# EasyEDA Pro project ProDoc_Schematic1.epro

# Schematic Schematic1

## Sheets
1 P1: Board Name: Board1; Create Date: 2025-09-09; Page Name: P1; Project Name: usbc-fursuit-fan; Schematic Name: Schematic1; Update Date: 2025-09-09; Company: EasyEDA.com; Page Size: A4; Version: V1.0
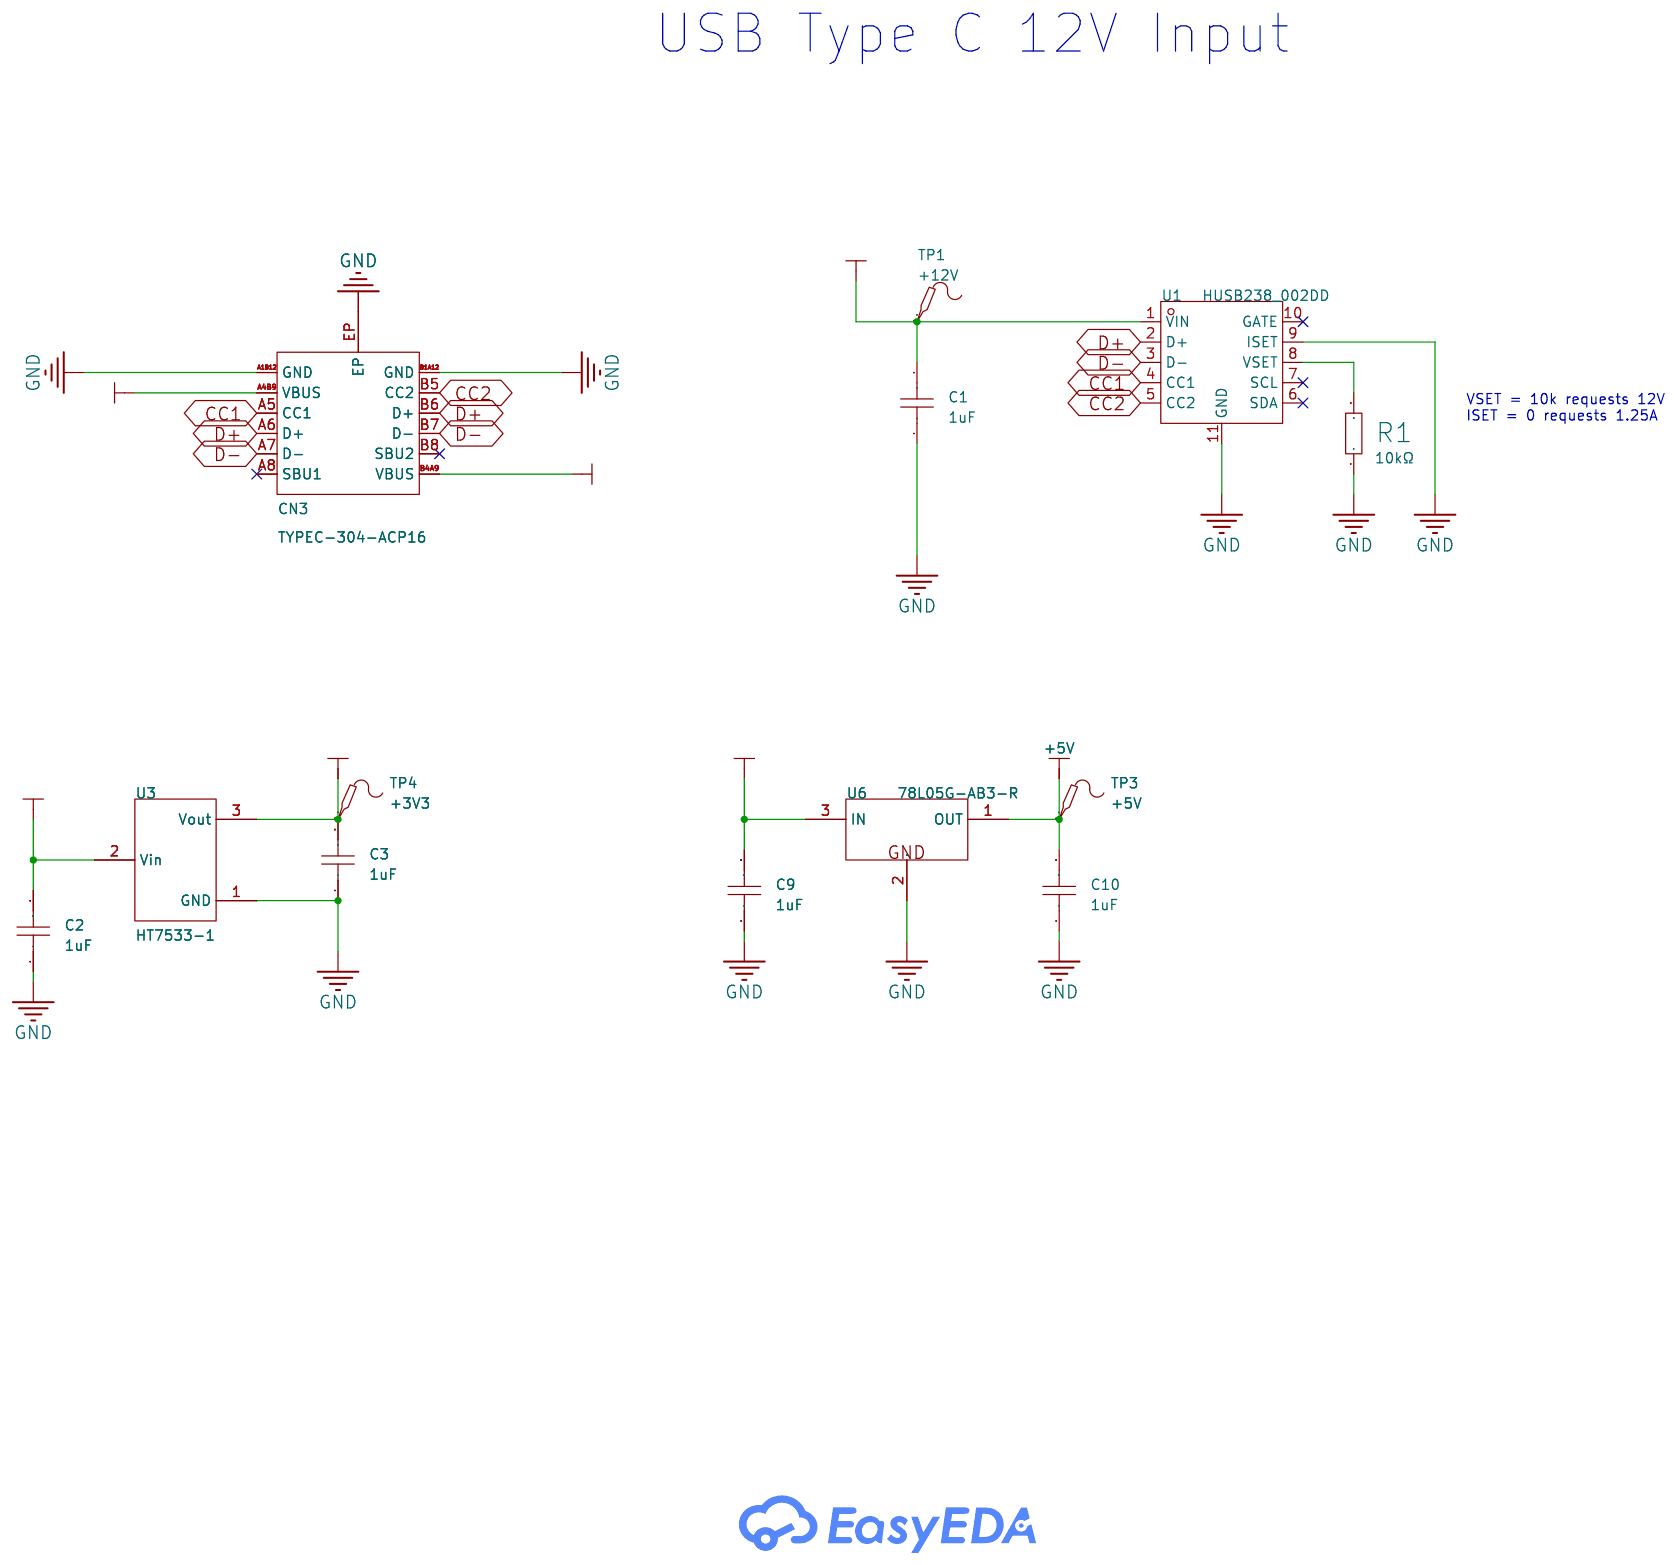
[diagram p0: P1]
2 P2: Page Name: P2; Update Date: 2025-09-11
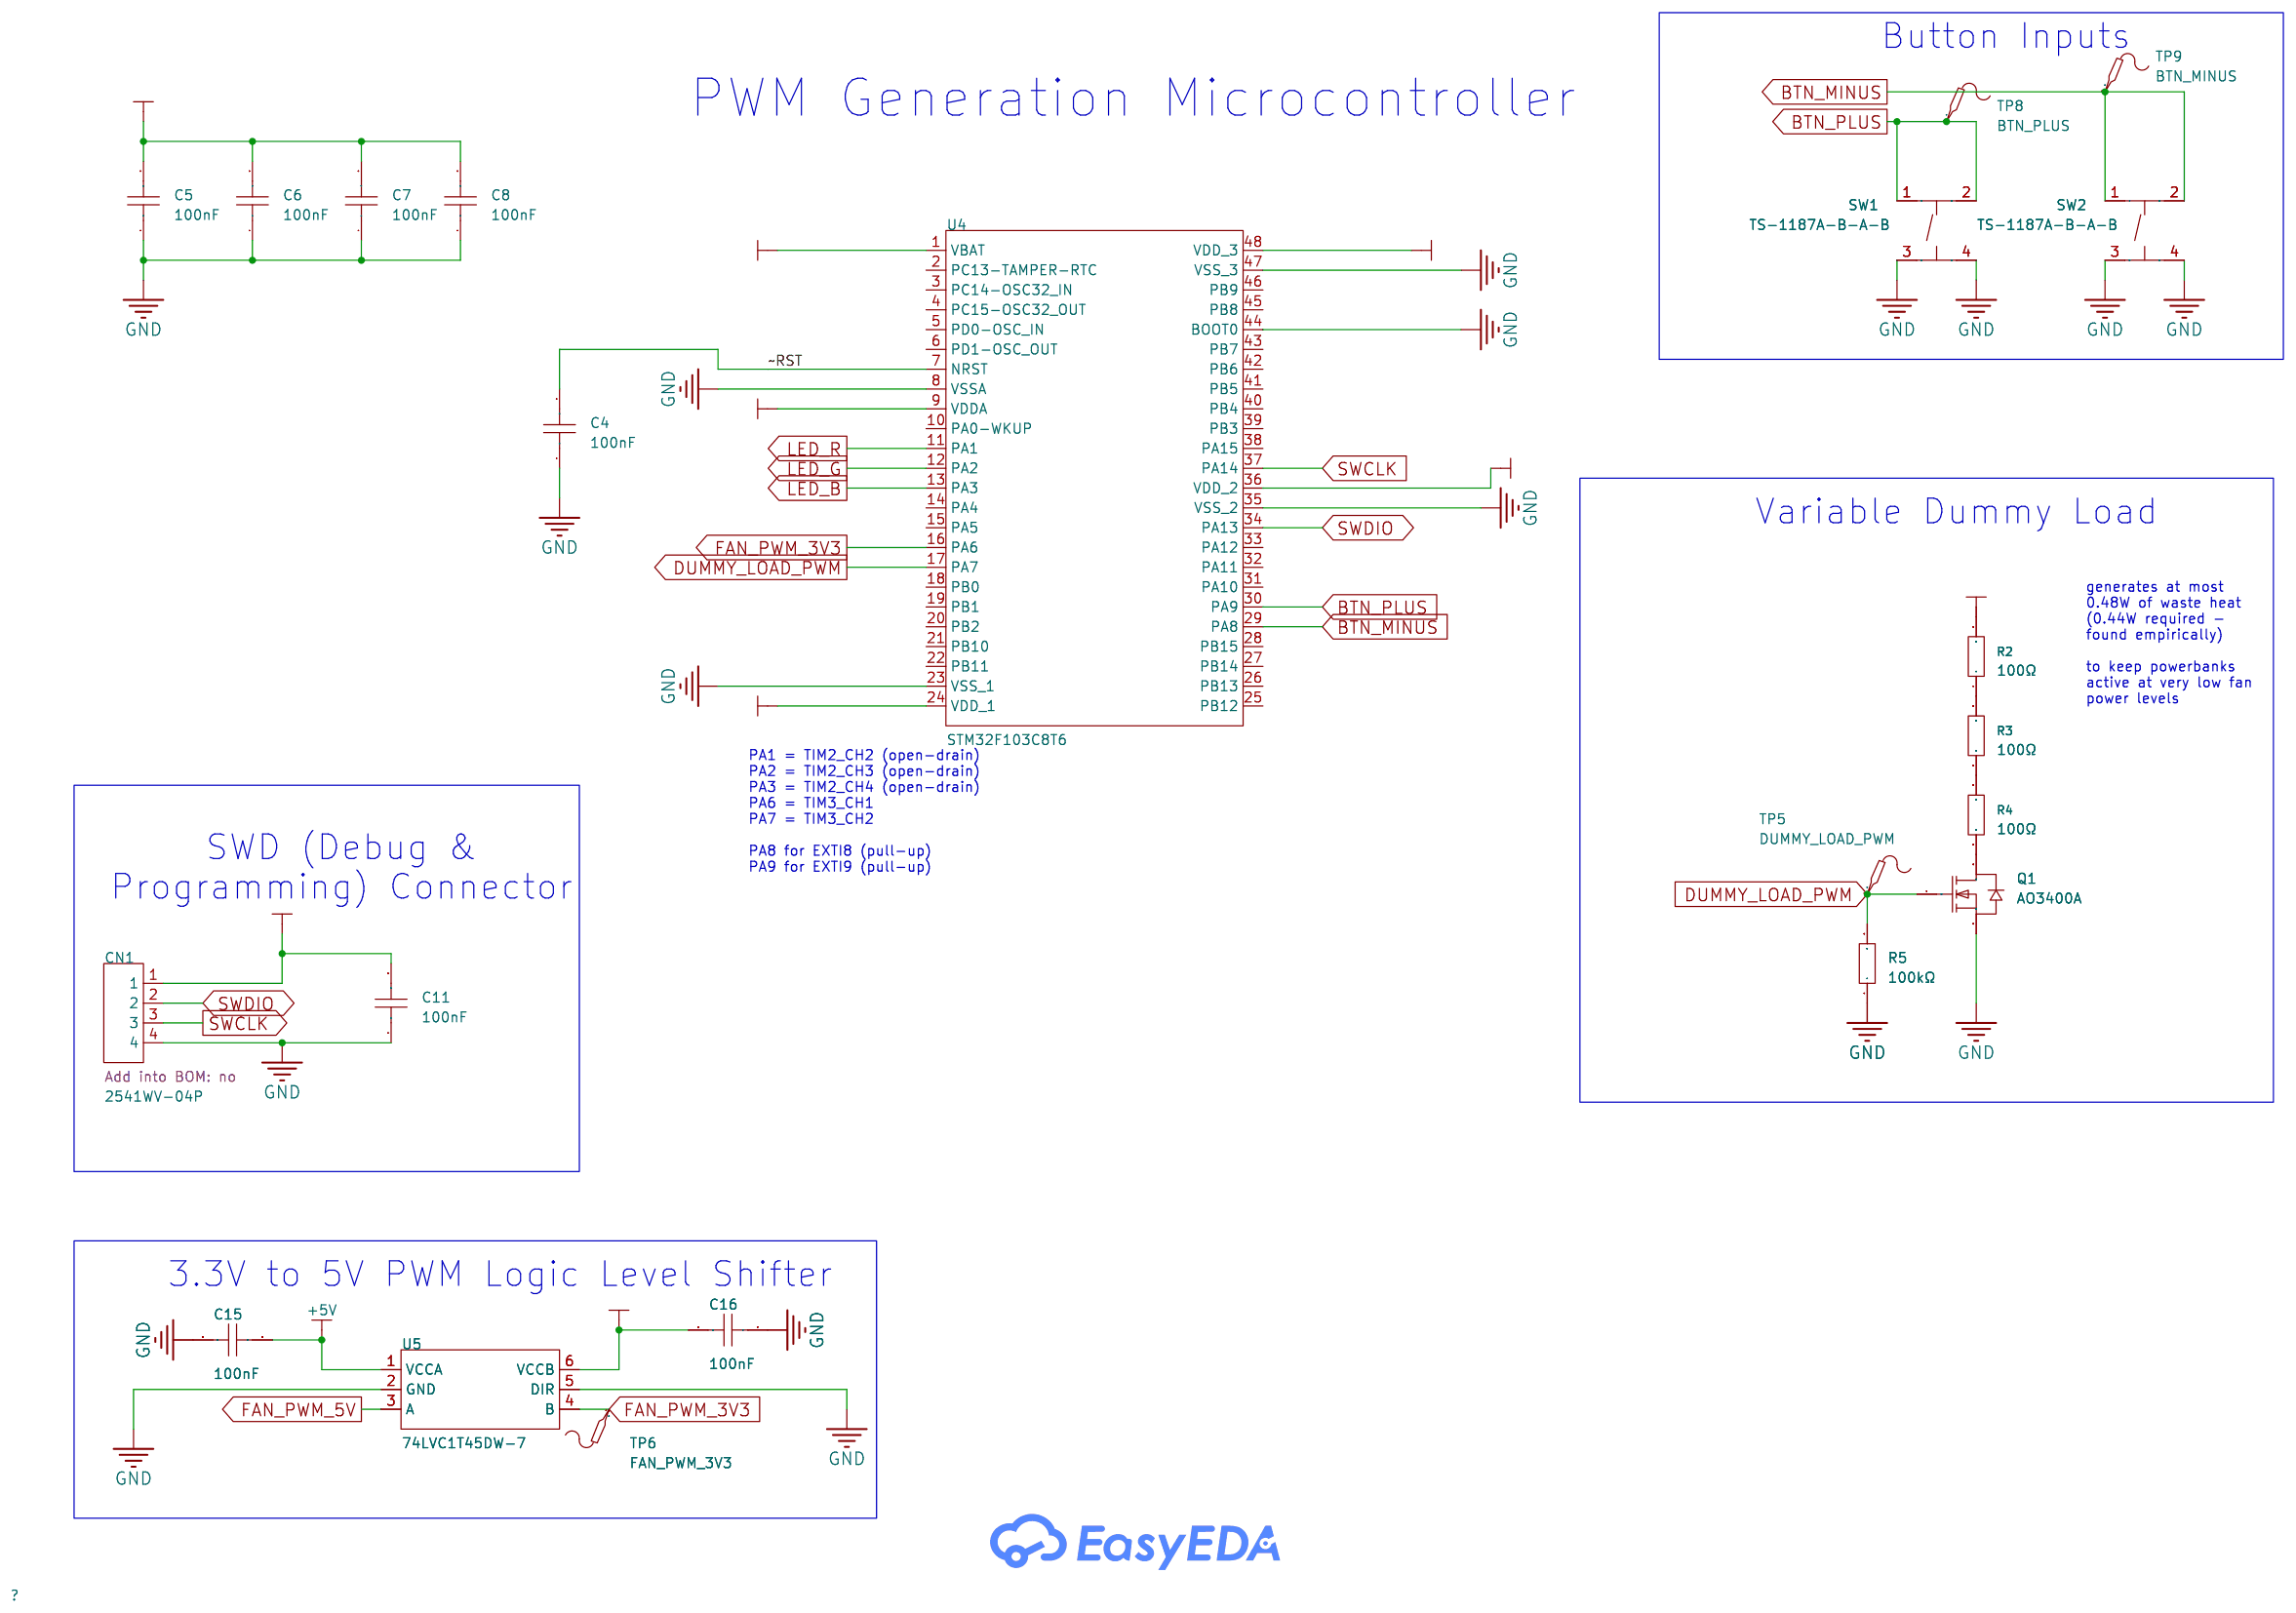
[diagram p1: P2]
3 P3: Page Name: P3; Update Date: 2025-09-11
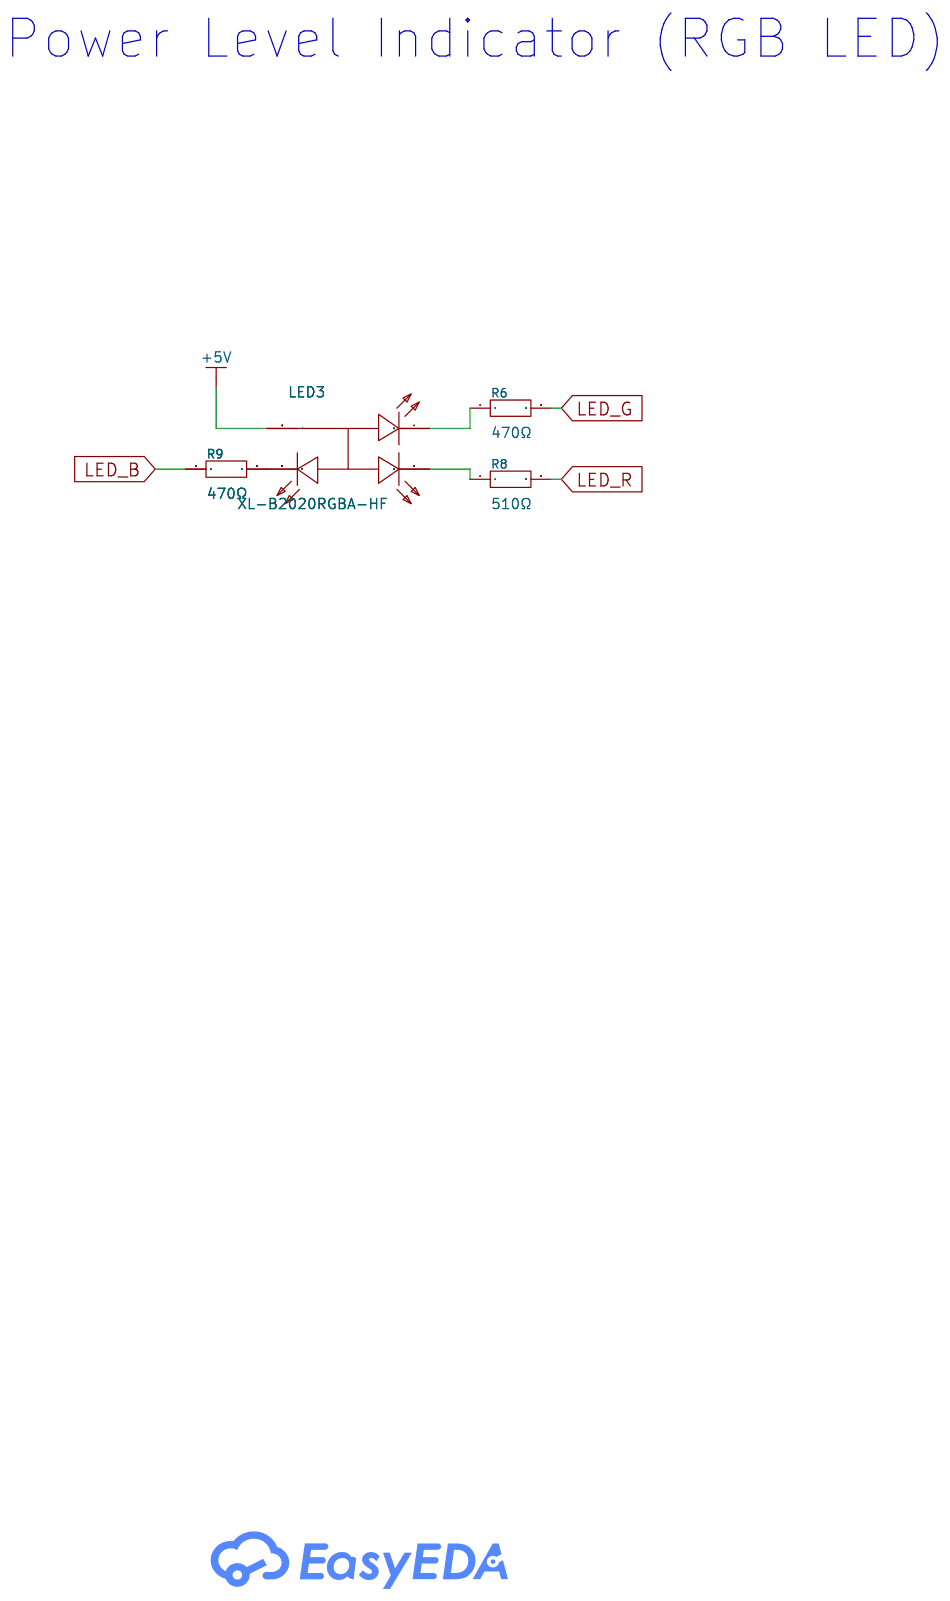
[diagram p2: P3]
4 P4: Create Date: 2025-09-10; Page Name: P4; Update Date: 2025-09-11
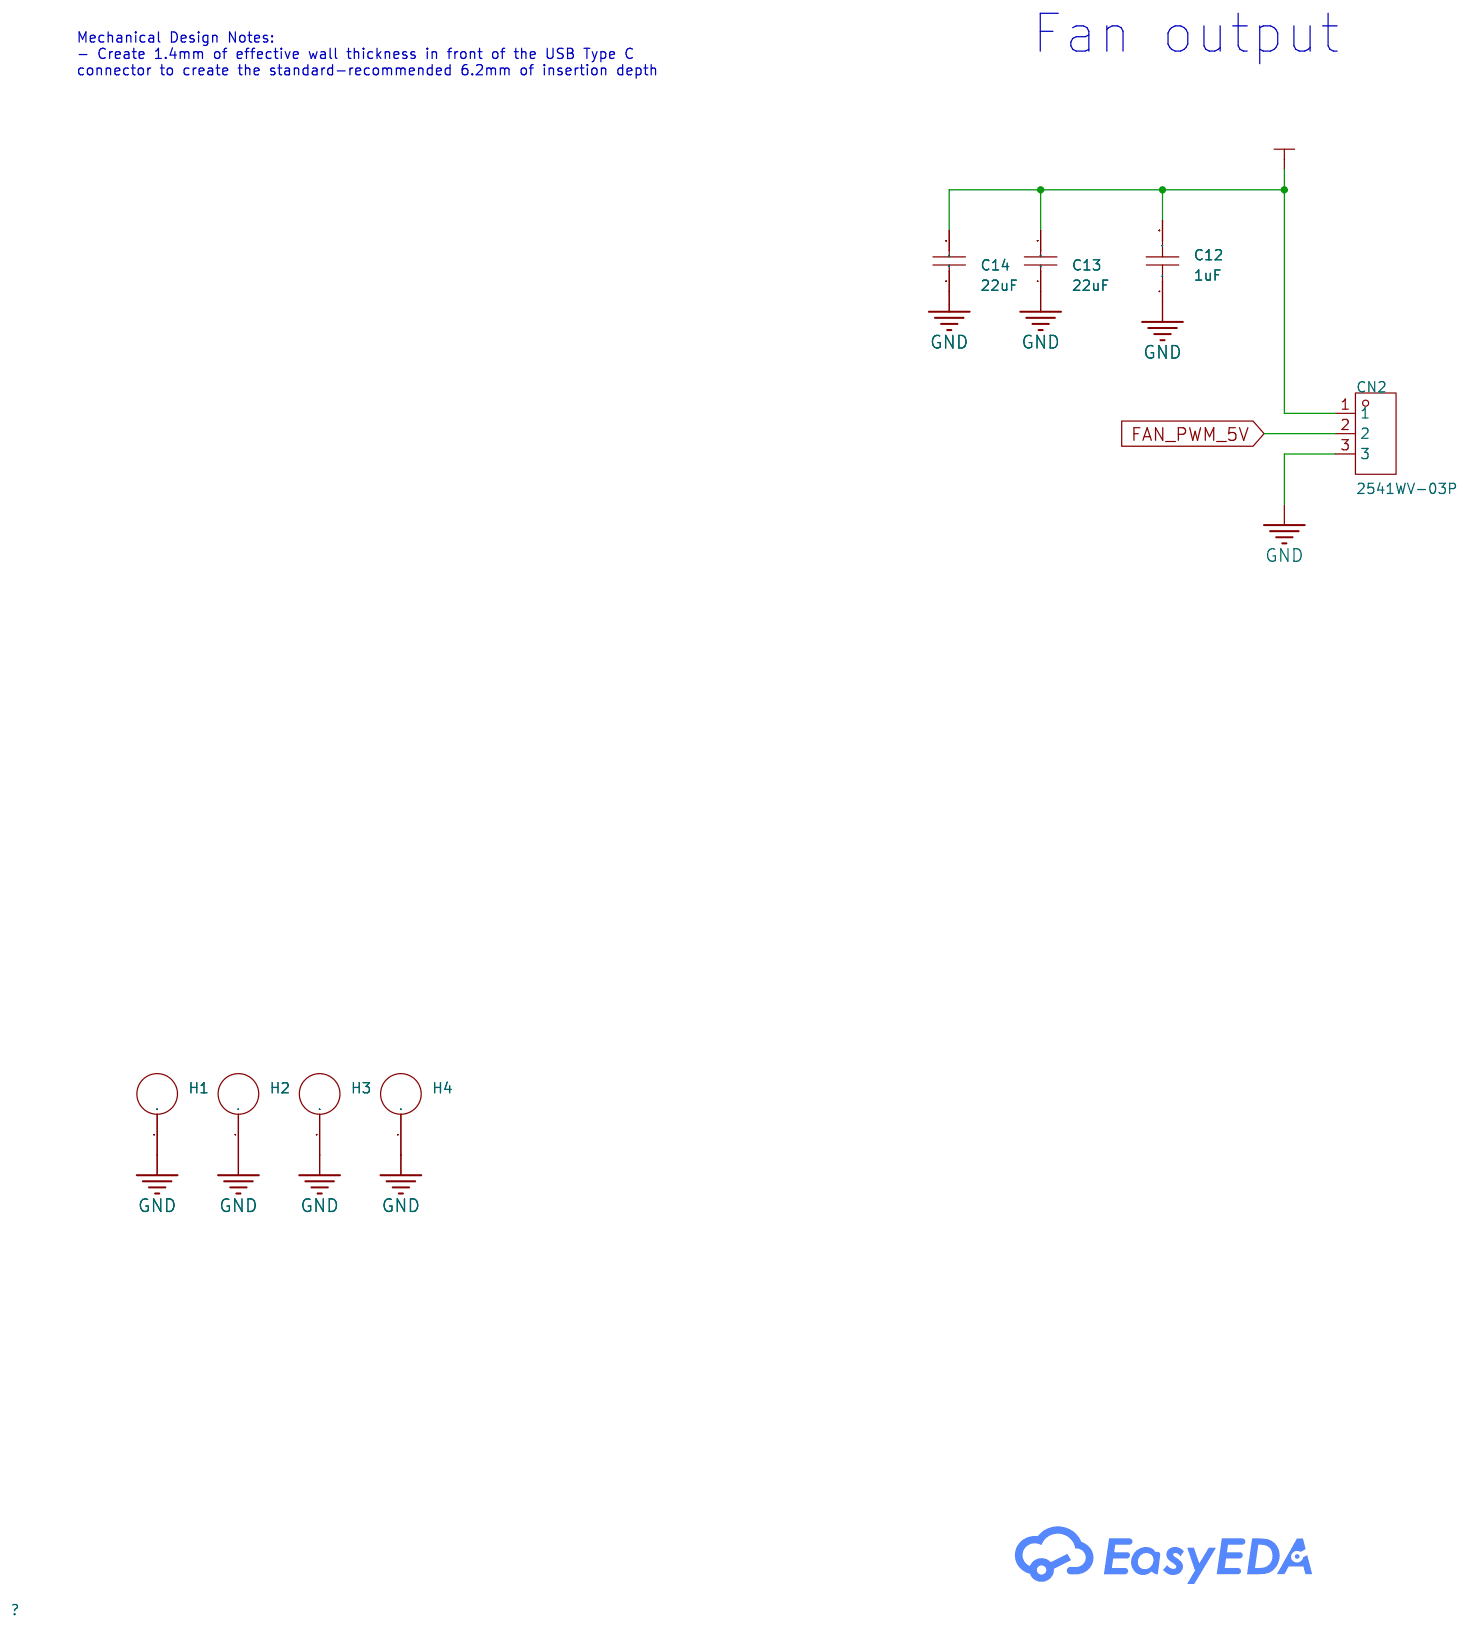
[diagram p3: P4]

## Parts
sheet P1
C1  1uF  [C0603]
C2  1uF  [C0603]
C3  1uF  [C0603]
C9  1uF  [C0603]
C10  1uF  [C0603]
CN3  TYPEC-304-ACP16  [USB-C-SMD_TYPE-C-16P-1]
R1  10kΩ  [R0603]
TP1  +12V  [Test-Point-0.5mm]
TP3  +5V  [Test-Point-0.5mm]
TP4  +3V3  [Test-Point-0.5mm]
U1  HUSB238_002DD  [DFN-10_L3.0-W3.0-P0.50-BL-EP2.5]
U3  HT7533-1  [SOT-89-3_L4.5-W2.5-P1.50-LS4.2-BR]
U6  78L05G-AB3-R  [SOT-89-3_L4.5-W2.5-P1.50-LS4.2-BR]
sheet P2
C4  100nF  [C0603]
C5  100nF  [C0603]
C6  100nF  [C0603]
C7  100nF  [C0603]
C8  100nF  [C0603]
C11  100nF  [C0603]
C15  100nF  [C0603]
C16  100nF  [C0603]
CN1  2541WV-04P  [HDR-TH_4P-P2.54-V-M-1]  (no BOM)
Q1  AO3400A  [SOT-23-3_L2.9-W1.3-P1.90-LS2.4-BR]
R2  100Ω  [R1206]
R3  100Ω  [R1206]
R4  100Ω  [R1206]
R5  100kΩ  [R0603]
SW1  TS-1187A-B-A-B  [SW-SMD_4P-L5.1-W5.1-P3.70-LS6.5-TL_H1.5]
SW2  TS-1187A-B-A-B  [SW-SMD_4P-L5.1-W5.1-P3.70-LS6.5-TL_H1.5]
TP5  DUMMY_LOAD_PWM  [Test-Point-0.5mm]
TP6  FAN_PWM_3V3  [Test-Point-0.5mm]
TP8  BTN_PLUS  [Test-Point-0.5mm]
TP9  BTN_MINUS  [Test-Point-0.5mm]
U4  STM32F103C8T6  [LQFP-48_L7.0-W7.0-P0.50-LS9.0-BL]
U5  74LVC1T45DW-7  [SC-70-6_L2.2-W1.3-P0.65-LS2.1-BR]
sheet P3
LED3  XL-B2020RGBA-HF  [LED-SMD_4P-L2.1-W2.1-P1.0-BL]
R6  470Ω  [R0402]
R8  510Ω  [R0402]
R9  470Ω  [R0402]
sheet P4
C12  1uF  [C0603]
C13  22uF  [C1206]
C14  22uF  [C1206]
CN2  2541WV-03P  [HDR-TH_3P-P2.54-V-M-2]  (no BOM)
H1  -  [HOLE_D2M5_D4M0_PAD_PTH]
H2  -  [HOLE_D2M5_D4M0_PAD_PTH]
H3  -  [HOLE_D2M5_D4M0_PAD_PTH]
H4  -  [HOLE_D2M5_D4M0_PAD_PTH]

## Library data of the parts
C1-C3 C9 C10 C12 = CL10A105KB8NNNC: Capacitance:1uF Tolerance:±10% Tolerance:±10% Voltage Rating:50V Temperature Coefficient:X5R; LCSC Part Name: 1uF ±10% 50V; Supplier Part: C15849; Manufacturer: SAMSUNG(三星); Supplier Footprint: 0603; JLCPCB Part Class: Basic Part; Datasheet: https://item.szlcsc.com/datasheet/CL10A105KB8NNNC/16531.html; Supplier: LCSC; Tolerance: ±10%; Voltage Rating: 50V; Temperature Coefficient: X5R
CN3 = TYPEC-304-ACP16: Connector Type:Type-C Protocol Standard:- Gender:Female Mounting Type:Surface Mount, Right Angle Number of Contacts:16P Number of Ports:1 Current Rating-Power:3A Voltage Rating:20V Connect-Disconnect Life:10,000 Cycles Length:7.35mm Detection color:Black; LCSC Part Name: Type-C 母 卧贴; Supplier Part: C2982555; Manufacturer: XUNPU(讯普); Supplier Footprint: SMD; JLCPCB Part Class: Extended Part; Datasheet: https://item.szlcsc.com/datasheet/TYPEC-304-ACP16/3412817.html; Supplier: LCSC; Connector Type: Type-C; Gender: Female; Mounting Type: Surface Mount, Right Angle; Number of Contacts: 16P; Number of Ports: 1; Current Rating-Power: 3A; Voltage Rating: 20V; Connect-Disconnect Life: 10,000 Cycles; Length: 7.35mm; Detection color: Black; Operating Temperature: -40℃~+85℃
R1 = 0603WAF1002T5E: Type:Thick Film Resistor Resistance:10kΩ Tolerance:±1% Tolerance:±1% Power(Watts):100mW Voltage-Supply(Max):75V Temperature Coefficient:±100ppm/℃ Temperature Coefficient:±100ppm/℃ Operating Temperature:-55℃~+155℃ Operating Temperature:-55℃~+155℃; LCSC Part Name: 厚膜电阻 10kΩ ±1% 100mW; Supplier Part: C25804; Manufacturer: UNI-ROYAL(厚声); Supplier Footprint: 0603; JLCPCB Part Class: Basic Part; Datasheet: https://item.szlcsc.com/datasheet/0603WAF1002T5E/26547.html; Supplier: LCSC; Type: Thick Film Resistor; Tolerance: ±1%; Power(Watts): 100mW; Voltage-Supply(Max): 75V; Temperature Coefficient: ±100ppm/℃; Operating Temperature: -55℃~+155℃
TP1 TP3-TP6 TP8 TP9 = Test-Point: Test Point 测试点
U1 = HUSB238_002DD: Supplier Part: C7471904; Manufacturer: Hynetek(慧能泰); Supplier Footprint: DFN-10L(3x3); JLCPCB Part Class: Extended Part; Datasheet: https://item.szlcsc.com/datasheet/HUSB238_002DD/8528237.html; Supplier: LCSC
U3 = HT7533-1_C14289: Output Type:Fixed Voltage - Supply:30V Output Voltage:3.3V Output Voltage:3.3V Output Current:100mA Power Supply Rejection Ratio (PSRR):- Voltage Dropout:55mV@(1mA) standby current:- Output Configuration:Positive electrode Number of Outputs:1; LCSC Part Name: 输入30V 输出3.3V 100mA; Supplier Part: C14289; Manufacturer: HOLTEK(合泰/盛群); Supplier Footprint: SOT-89-3; JLCPCB Part Class: Basic Part; Datasheet: https://atta.szlcsc.com/upload/public/pdf/source/20250210/C9238B1D00F83046D6644632F130CE9C.pdf; Supplier: LCSC; Output Type: Fixed; Voltage - Supply: 30V; Output Voltage: 3.3V; Output Current: 100mA; Voltage Dropout: 55mV@(1mA); Output Configuration: Positive electrode; Number of Outputs: 1
U6 = 78L05G-AB3-R: Output Type:Fixed Voltage - Supply:30V Output Voltage:5V Output Voltage:5V Output Current:100mA Power Supply Rejection Ratio (PSRR):- Voltage Dropout:1.7V@(40mA) Noise:- Features:Short Circuit Protection；Over Temperature Protection；Over Current Protection; LCSC Part Name: 输入30V 输出5V 100mA; Supplier Part: C71136; Manufacturer: UTC(友顺); Supplier Footprint: SOT-89-3; JLCPCB Part Class: Basic Part; Datasheet: https://item.szlcsc.com/datasheet/78L05G-AB3-R/72235.html; Supplier: LCSC; Output Type: Fixed; Voltage - Supply: 30V; Output Voltage: 5V; Output Current: 100mA; Voltage Dropout: 1.7V@(40mA); Features: Short Circuit Protection；Over Temperature Protection；Over Current Protection; Operating Temperature: -40℃~+85℃; Output Configuration: Positive; Number of Outputs: 1
C4-C8 C11 C15 C16 = CC0603KRX7R9BB104: Capacitance:100nF Tolerance:±10% Tolerance:±10% Voltage Rating:50V Temperature Coefficient:X7R; LCSC Part Name: 100nF ±10% 50V; Supplier Part: C14663; Manufacturer: YAGEO(国巨); Supplier Footprint: 0603; JLCPCB Part Class: Basic Part; Datasheet: https://item.szlcsc.com/datasheet/CC0603KRX7R9BB104/15331.html; Supplier: LCSC; Tolerance: ±10%; Voltage Rating: 50V; Temperature Coefficient: X7R
CN1 = 2541WV-04P: Pin Structure:1x4P Pitch:2.54mm Circluar Pins/Square Pins:Pin Header Mounting Type:Through Hole Number of Rows:1 Number of Pins:4P Length of Mating Pin:6mm Insulation Height:2.54mm Length of End Connection Pin:3mm Contact Plating:Gold Operating Temperatur; LCSC Part Name: 1x4P 间距:2.54mm 方针 直插; Supplier Part: C5383113; Manufacturer: HanElectricity(瀚源); Supplier Footprint: 插件,P=2.54mm; JLCPCB Part Class: Extended Part; Datasheet: https://item.szlcsc.com/datasheet/2541WV-04P/6258473.html; Supplier: LCSC; Pin Structure: 1x4P; Pitch: 2.54mm; Circluar Pins/Square Pins: Pin Header; Mounting Type: Through Hole; Number of Rows: 1; Number of Pins: 4P; Length of Mating Pin: 6mm; Insulation Height: 2.54mm; Length of End Connection Pin: 3mm; Contact Plating: Gold; Operating Temperature: -55℃~+105℃
Q1 = AO3400A_C20917: Number:- Drain to Source Voltage:30V Current - Continuous Drain(Id):- RDS(on):48mΩ@2.5V Pd - Power Dissipation:- Gate Threshold Voltage (Vgs(th)):1.45V@250uA Gate Charge(Qg):7nC@10V Input Capacitance(Ciss):630pF@15V Reverse Transfer Capacitance (Crss@Vds); LCSC Part Name: 1个N沟道 耐压:30V 电流:5.7A; Supplier Part: C20917; Manufacturer: AOS; Supplier Footprint: SOT-23-3L; JLCPCB Part Class: Basic Part; Datasheet: https://item.szlcsc.com/datasheet/AO3400A/21629.html; Supplier: LCSC; Drain to Source Voltage: 30V; RDS(on): 48mΩ@2.5V; Gate Threshold Voltage (Vgs(th)): 1.45V@250uA; Gate Charge(Qg): 7nC@10V; Input Capacitance(Ciss): 630pF@15V; Operating Temperature: -55℃~+150℃@(Tj); Type: N-Channel
R2-R4 = 1206W4F1000T5E_C17901: Type:Thick Film Resistor Resistance:100Ω Tolerance:±1% Tolerance:±1% Power(Watts):250mW Voltage-Supply(Max):200V Temperature Coefficient:±100ppm/℃ Temperature Coefficient:±100ppm/℃ Operating Temperature:-55℃~+155℃ Operating Temperature:-55℃~+155℃; LCSC Part Name: 100Ω ±1% 250mW 厚膜电阻; Supplier Part: C17901; Manufacturer: UNI-ROYAL(厚声); Manufacturer Part: 1206W4F1000T5E; Supplier Footprint: 1206; JLCPCB Part Class: Basic Part; Datasheet: https://item.szlcsc.com/datasheet/1206W4F1000T5E/18589.html; Supplier: LCSC; Type: Thick Film Resistor; Tolerance: ±1%; Power(Watts): 250mW; Voltage-Supply(Max): 200V; Temperature Coefficient: ±100ppm/℃; Operating Temperature: -55℃~+155℃
R5 = 0603WAF1003T5E: Type:Thick Film Resistor Resistance:100kΩ Tolerance:±1% Tolerance:±1% Power(Watts):100mW Voltage-Supply(Max):75V Temperature Coefficient:±100ppm/℃ Temperature Coefficient:±100ppm/℃ Operating Temperature:-55℃~+155℃ Operating Temperature:-55℃~+155℃; LCSC Part Name: 100kΩ ±1% 100mW 厚膜电阻; Supplier Part: C25803; Manufacturer: UNI-ROYAL(厚声); Supplier Footprint: 0603; JLCPCB Part Class: Basic Part; Datasheet: https://item.szlcsc.com/datasheet/0603WAF1003T5E/26546.html; Supplier: LCSC; Type: Thick Film Resistor; Tolerance: ±1%; Power(Watts): 100mW; Voltage-Supply(Max): 75V; Temperature Coefficient: ±100ppm/℃; Operating Temperature: -55℃~+155℃
SW1 SW2 = TS-1187A-B-A-B: Circuit:SPST Actuator Style:Round Button Operating Force:1.6N Mounting Type:Surface Mount,Vertical Length:5.1mm Width:5.1mm Switch Height:1.5mm with Bracket:Without Bracket Contact Current:50mA Voltage Rating:12V Actuator/Cap Color:Gold With Lamp:No Life:; LCSC Part Name: 5.1*5.1*1.5mm 立贴 轻触开关; Supplier Part: C318884; Manufacturer: XKB Connection(中国星坤); Supplier Footprint: SMD; JLCPCB Part Class: Basic Part; Datasheet: https://item.szlcsc.com/datasheet/TS-1187A-B-A-B/299976.html; Supplier: LCSC; Circuit: SPST; Actuator Style: Round Button; Operating Force: 1.6N; Mounting Type: Surface Mount,Vertical; Length: 5.1mm; Width: 5.1mm; Switch Height: 1.5mm; with Bracket: Without Bracket; Contact Current: 50mA; Voltage Rating: 12V; Actuator/Cap Color: Gold; With Lamp: No; Life: 100,000 Cycles; Operating Temperature: -30℃~+85℃
U4 = STM32F103C8T6: CPU Core:ARM-M3 CPU Maximum Speed:72MHz Program Storage Size:64KB Program Memory Type:FLASH Number of I/O:37 ADC (Bit):12bit Voltage - Supply:2V~3.6V Voltage - Supply:2V~3.6V Applications:-; LCSC Part Name: 主流增强型ARM Cortex-M3 MCU，具有64 KB Flash、72 MHz CPU、电机控制、USB和CAN; Supplier Part: C8734; Manufacturer: ST(意法半导体); Supplier Footprint: LQFP-48(7x7); JLCPCB Part Class: Extended Part; Datasheet: https://item.szlcsc.com/datasheet/STM32F103C8T6/9243.html; Supplier: LCSC; CPU Core: ARM-M3; CPU Maximum Speed: 72MHz; Program Storage Size: 64KB; Program Memory Type: FLASH; Number of I/O: 37; ADC (Bit): 12bit; Voltage - Supply: 2V~3.6V
U5 = 74LVC1T45DW-7: Channel Type:Bidirectional Voltage - Supply(VCCA):1.65V~5.5V Voltage - Supply(VCCA):1.65V~5.5V Voltage - Supply(VCCB):1.65V~5.5V Voltage - Supply(VCCB):1.65V~5.5V Number of Circuits:1 Number of Circuits:1 Output Type:Tri-State Operating Temperature:-40℃~+; Supplier Part: C168855; Manufacturer: DIODES(美台); Supplier Footprint: SC-70-6(SOT-363); JLCPCB Part Class: Extended Part; Datasheet: https://item.szlcsc.com/datasheet/74LVC1T45DW-7/180239.html; Supplier: LCSC; Channel Type: Bidirectional; Voltage - Supply(VCCA): 1.65V~5.5V; Voltage - Supply(VCCB): 1.65V~5.5V; Number of Circuits: 1; Output Type: Tri-State; Operating Temperature: -40℃~+125℃
LED3 = XL-B2020RGBA-HF: LCSC Part Name: 发光二极管 高亮度七彩 封装：2020黑色哑光 功率 50mW；70mW；70mW 正向电流 20mA 主波长 620nm~630nm；520~530nm；460~470nm 峰值波长 625nm; 520nm; 465nm 工作温度 -20℃~+85℃; Supplier Part: C22461782; Manufacturer: XINGLIGHT(成兴光); Supplier Footprint: SMD-4P,2.1x2.1mm; JLCPCB Part Class: Extended Part; Datasheet: https://atta.szlcsc.com/upload/public/pdf/source/20240613/35F2B2E569AC177F1ACCCDF654FDB2DF.pdf; Supplier: LCSC
R6 R9 = 0402WGF4700TCE: Type:Thick Film Resistor Resistance:470Ω Tolerance:±1% Tolerance:±1% Power(Watts):62.5mW Voltage-Supply(Max):50V Temperature Coefficient:±100ppm/℃ Temperature Coefficient:±100ppm/℃ Operating Temperature:-55℃~+155℃ Operating Temperature:-55℃~+155℃; LCSC Part Name: 470Ω ±1% 62.5mW 厚膜电阻; Supplier Part: C25117; Manufacturer: UNI-ROYAL(厚声); Supplier Footprint: 0402; JLCPCB Part Class: Basic Part; Datasheet: https://item.szlcsc.com/datasheet/0402WGF4700TCE/25860.html; Supplier: LCSC; Type: Thick Film Resistor; Tolerance: ±1%; Power(Watts): 62.5mW; Voltage-Supply(Max): 50V; Temperature Coefficient: ±100ppm/℃; Operating Temperature: -55℃~+155℃
R8 = 0402WGF5100TCE: Type:Thick Film Resistor Resistance:510Ω Tolerance:±1% Tolerance:±1% Power(Watts):62.5mW Voltage-Supply(Max):50V Temperature Coefficient:±100ppm/℃ Temperature Coefficient:±100ppm/℃ Operating Temperature:-55℃~+155℃ Operating Temperature:-55℃~+155℃; LCSC Part Name: 510Ω ±1% 62.5mW 厚膜电阻; Supplier Part: C25123; Manufacturer: UNI-ROYAL(厚声); Supplier Footprint: 0402; JLCPCB Part Class: Basic Part; Datasheet: https://item.szlcsc.com/datasheet/0402WGF5100TCE/25866.html; Supplier: LCSC; Type: Thick Film Resistor; Tolerance: ±1%; Power(Watts): 62.5mW; Voltage-Supply(Max): 50V; Temperature Coefficient: ±100ppm/℃; Operating Temperature: -55℃~+155℃
C13 C14 = CL31A226KAHNNNE: Capacitance:22uF Tolerance:±10% Tolerance:±10% Voltage Rating:25V Temperature Coefficient:X5R; LCSC Part Name: 22uF ±10% 25V; Supplier Part: C12891; Manufacturer: SAMSUNG(三星); Supplier Footprint: 1206; JLCPCB Part Class: Basic Part; Datasheet: https://item.szlcsc.com/datasheet/CL31A226KAHNNNE/13537.html; Supplier: LCSC; Tolerance: ±10%; Voltage Rating: 25V; Temperature Coefficient: X5R
CN2 = 2541WV-03P: Pin Structure:1x3P Pitch:2.54mm Circluar Pins/Square Pins:Pin Header Mounting Type:Through Hole Number of Rows:1 Number of Pins:3P Length of Mating Pin:6mm Insulation Height:2.54mm Length of End Connection Pin:3mm Contact Plating:Gold Operating Temperatur; LCSC Part Name: 1x3P 间距:2.54mm 方针 直插; Supplier Part: C5383112; Manufacturer: HanElectricity(瀚源); Supplier Footprint: 插件,P=2.54mm; JLCPCB Part Class: Extended Part; Datasheet: https://item.szlcsc.com/datasheet/2541WV-03P/6258472.html; Supplier: LCSC; Pin Structure: 1x3P; Pitch: 2.54mm; Circluar Pins/Square Pins: Pin Header; Mounting Type: Through Hole; Number of Rows: 1; Number of Pins: 3P; Length of Mating Pin: 6mm; Insulation Height: 2.54mm; Length of End Connection Pin: 3mm; Contact Plating: Gold; Operating Temperature: -55℃~+105℃
H1-H4 = HOLE_D2M5_D4M0_PAD_PTH: 2.5mm diameter plated M3 clearance hole with 4.0mm diameter pad around it to clear nuts and washers. The symbol has a pin to connect this pad to a net if required. Place a Not Connected 'X' on the pin if the hole is to be isolated.

## Nets
+3V3: C3.2 C5.2 C6.2 C7.2 C8.2 C11.2 C16.2 CN1.1 TP4.1 U3.3(Vout) U4.1(VBAT) U4.9(VDDA) U4.24(VDD_1) U4.36(VDD_2) U4.48(VDD_3) U5.6(VCCB)
+5V: C10.2 C15.1 LED3.3(A) TP3.1 U5.1(VCCA) U6.1(OUT)
+12V: C1.2 C2.2 C9.2 C12.2 C13.2 C14.2 CN2.1 CN3.A4B9(VBUS) CN3.B4A9(VBUS) R2.2 TP1.1 U1.1(VIN) U3.2(Vin) U6.3(IN)
GND: C1.1 C2.1 C3.1 C4.1 C5.1 C6.1 C7.1 C8.1 C9.1 C10.1 C11.1 C12.1 C13.1 C14.1 C15.2 C16.1 CN1.4 CN2.3 CN3.A1B12(GND) CN3.B1A12(GND) CN3.EP H1.1 H2.1 H3.1 H4.1 Q1.2(S) R1.1 R5.1 SW1.3(C) SW1.4(D) SW2.3(C) SW2.4(D) U1.9(ISET) U1.11(GND) U3.1(GND) U4.8(VSSA) U4.23(VSS_1) U4.35(VSS_2) U4.44(BOOT0) U4.47(VSS_3) U5.2(GND) U5.5(DIR) U6.2(GND)
BTN_MINUS: SW2.1(A) SW2.2(B) TP9.1 U4.29(PA8)
BTN_PLUS: SW1.1(A) SW1.2(B) TP8.1 U4.30(PA9)
CC1: CN3.A5(CC1) U1.4(CC1)
CC2: CN3.B5(CC2) U1.5(CC2)
D+: CN3.A6(D+) CN3.B6(D+) U1.2(D+)
D-: CN3.A7(D-) CN3.B7(D-) U1.3(D-)
DUMMY_LOAD_PWM: Q1.1(G) R5.2 TP5.1 U4.17(PA7)
FAN_PWM_3V3: TP6.1 U4.16(PA6) U5.4(B)
FAN_PWM_5V: CN2.2 U5.3(A)
LED_B: R9.1 U4.13(PA3)
LED_G: R6.2 U4.12(PA2)
LED_R: R8.2 U4.11(PA1)
SWCLK: CN1.3 U4.37(PA14)
SWDIO: CN1.2 U4.34(PA13)
~RST: C4.2 U4.7(NRST)
Net-(LED3-1): LED3.1(C) R8.1
Net-(LED3-2): LED3.2(C) R9.2
Net-(LED3-4): LED3.4(C) R6.1
Net-(Q1-3): Q1.3(D) R4.1
Net-(R1-2): R1.2 U1.8(VSET)
Net-(R2-1): R2.1 R3.2
Net-(R3-1): R3.1 R4.2

Not connected (* = marked no-connect by the designer): CN3 A8(SBU1)* B8(SBU2)*; U1 6(SDA)* 7(SCL)* 10(GATE)*; U4 2(PC13-TAMPER-RTC) 3(PC14-OSC32_IN) 4(PC15-OSC32_OUT) 5(PD0-OSC_IN) 6(PD1-OSC_OUT) 10(PA0-WKUP) 14(PA4) 15(PA5) 18(PB0) 19(PB1) 20(PB2) 21(PB10) 22(PB11) 25(PB12) 26(PB13) 27(PB14) 28(PB15) 31(PA10) 32(PA11) 33(PA12) 38(PA15) 39(PB3) 40(PB4) 41(PB5) 42(PB6) 43(PB7) 45(PB8) 46(PB9)

## Notes on the sheets
sheet 1
- USB Type C 12V Input
- VSET = 10k requests 12V
  ISET = 0 requests 1.25A
sheet 2
- Button Inputs
- PWM Generation Microcontroller
- Variable Dummy Load
- generates at most
  0.48W of waste heat
  (0.44W required -
  found empirically)
  to keep powerbanks
  active at very low fan
  power levels
- SWD (Debug &
  Programming) Connector
- PA1 = TIM2_CH2 (open-drain)
  PA2 = TIM2_CH3 (open-drain)
  PA3 = TIM2_CH4 (open-drain)
  PA6 = TIM3_CH1
  PA7 = TIM3_CH2
  PA8 for EXTI8 (pull-up)
  PA9 for EXTI9 (pull-up)
- 3.3V to 5V PWM Logic Level Shifter
sheet 3
- Power Level Indicator (RGB LED)
sheet 4
- Fan output
- Mechanical Design Notes:
  - Create 1.4mm of effective wall thickness in front of the USB Type C
  connector to create the standard-recommended 6.2mm of insertion depth
